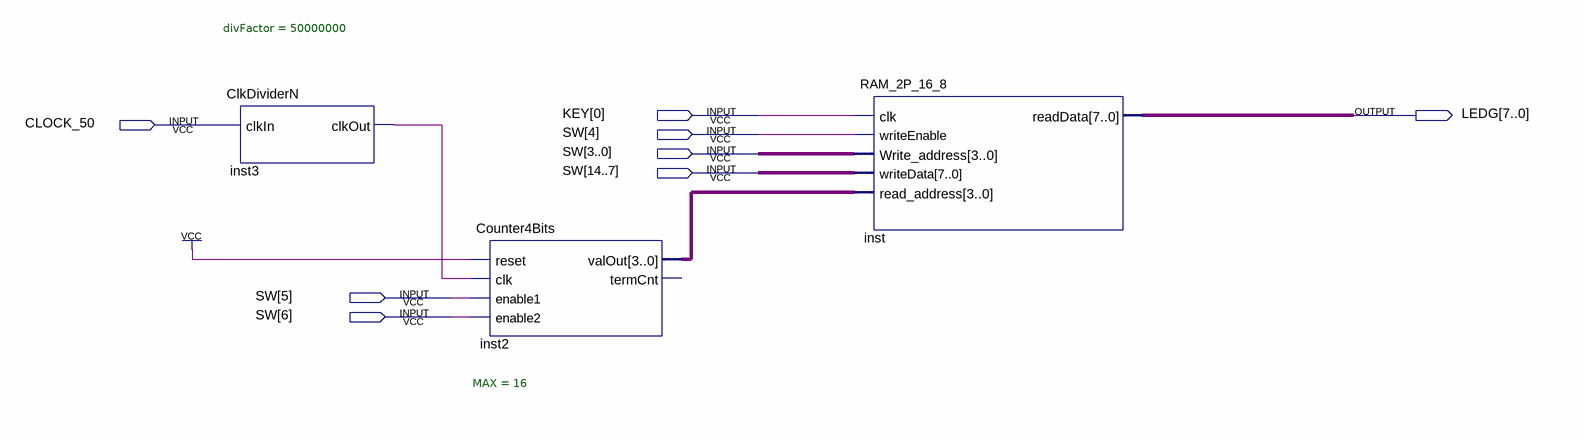
[diagram p0: schematic sheet]
// Quartus schematic RAM_2P_Demo.bdf as structural Verilog: 3 symbols, 8 pins
module RAM_2P_Demo (
  input  [0:0] KEY,
  input  CLOCK_50,
  input  [14:0] SW,
  output [7:0] LEDG
);

  wire inst3_clkout;
  wire [3:0] inst2_valout;

  ClkDividerN #(.divFactor(50000000)) inst3 (.clkIn(CLOCK_50), .clkOut(inst3_clkout));
  Counter4Bits #(.MAX(16)) inst2 (
    .reset(1'b1), .clk(inst3_clkout), .enable1(SW[5]), .enable2(SW[6]), .valOut(inst2_valout));  // open: termCnt
  RAM_2P_16_8 inst (
    .clk(KEY[0]), .writeEnable(SW[4]), .Write_address(SW[3:0]), .writeData(SW[14:7]),
    .read_address(inst2_valout), .readData(LEDG));
endmodule
